# Altium schematic sheet Schematic.SchDoc
size A; SheetNumber: 1; SheetTotal: 2
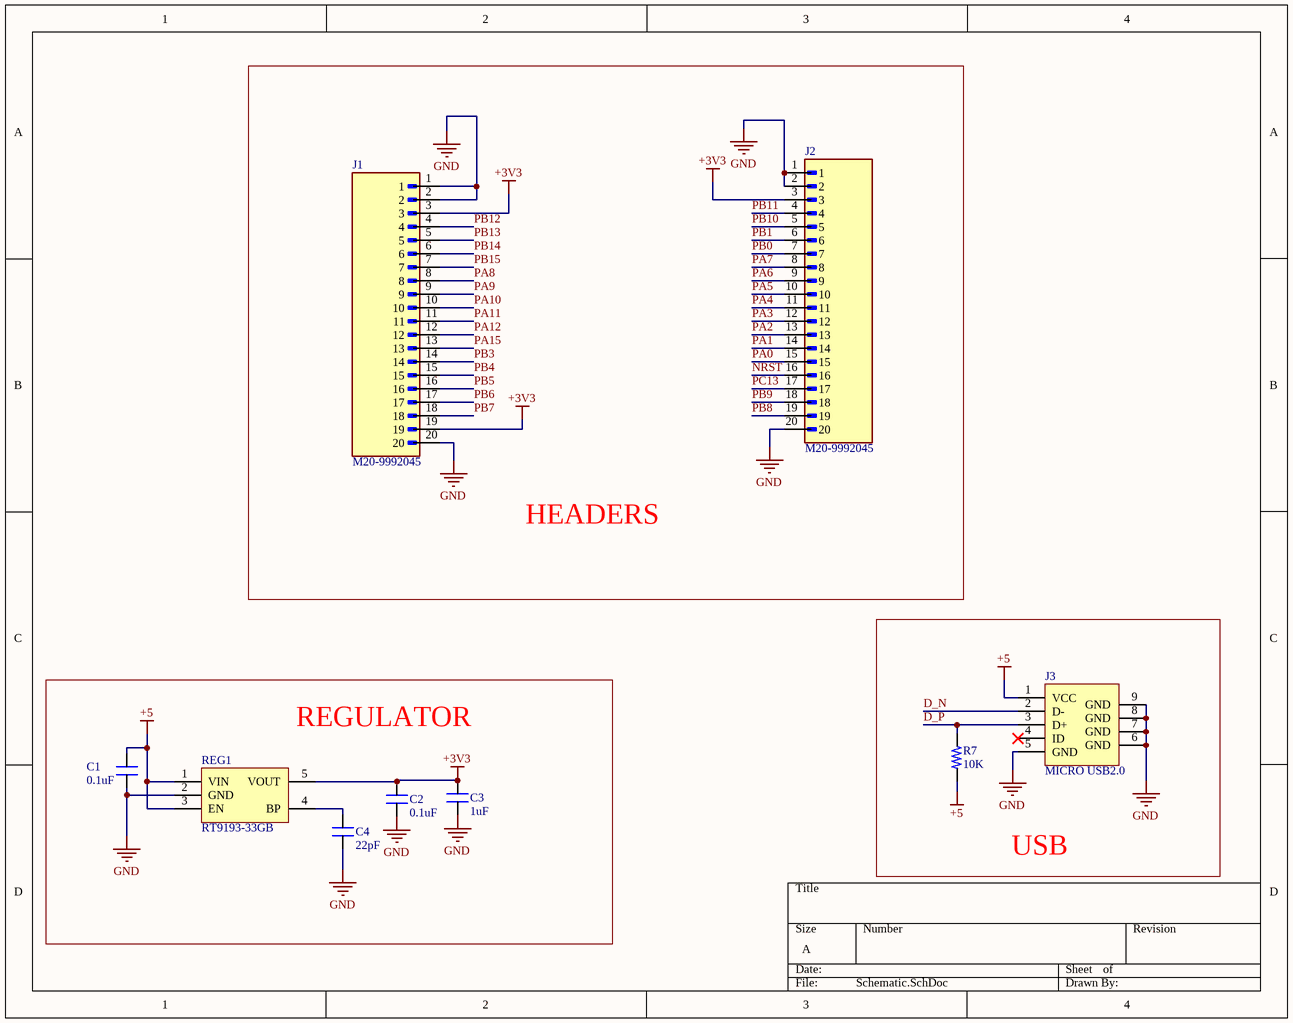
[diagram p0: Schematic.SchDoc]

## Parts
C1  0.1uF  [CAP_0805]
C2  0.1uF  [CAP_0805]
C3  1uF  [CAP_0805]
C4  22pF  [CAP_0805]
J1  M20-9992045  [HARWIN_M20-9992045]
J2  M20-9992045  [HARWIN_M20-9992045]
J3  MICRO USB2.0  [CON_10118192-0001LF_SMD]
R7  10K  [RES_0805]
REG1  RT9193-33GB  [SOT23-5]

## Blocks framed on the sheet
HEADERS: J1 J2
USB: J3 R7
REGULATOR: C1-C4 REG1

## Nets
+3V3: C2.2 C3.2 J1.3 J1.19 J2.3 REG1.5(VOUT)
+5: C1.2 J3.1(VCC) R7.1 REG1.1(VIN) REG1.3(EN)
GND: C1.1 C2.1 C3.1 C4.1 J1.1 J1.2 J1.20 J2.1 J2.2 J2.20 J3.5(GND) J3.6(GND) J3.7(GND) J3.8(GND) J3.9(GND) REG1.2(GND)
D_N: J3.2(D-)
D_P: J3.3(D+) R7.2
NRST: J2.16
PA0: J2.15
PA1: J2.14
PA2: J2.13
PA3: J2.12
PA4: J2.11
PA5: J2.10
PA6: J2.9
PA7: J2.8
PA8: J1.8
PA9: J1.9
PA10: J1.10
PA11: J1.11
PA12: J1.12
PA15: J1.13
PB0: J2.7
PB1: J2.6
PB3: J1.14
PB4: J1.15
PB5: J1.16
PB6: J1.17
PB7: J1.18
PB8: J2.19
PB9: J2.18
PB10: J2.5
PB11: J2.4
PB12: J1.4
PB13: J1.5
PB14: J1.6
PB15: J1.7
PC13: J2.17
NetC4_2: C4.2 REG1.4(BP)

Not connected (* = marked no-connect by the designer): J3 4(ID)*

## Library data of the parts
C1 C2 = CAP_0.1uF-50V-5%-0805: 0.1µF ±5% 50V Ceramic Capacitor X7R 0805 (2012 Metric); Manufacturer: KEMET; Manufacturing Part Number: C0805C104J5RACTU; Case/Package: 0805 (2012 Metric); Supplier-1: Digikey; Supplier Part Number-1: 399-1171-1-ND
C3 = CAP_1uF-50V-5%-0805: 1µF ±5% 50V Ceramic Capacitor X7R 0805 (2012 Metric); Manufacturer: Yageo; Manufacturing Part Number: CC0805JKX7R9BB105; Case/Package: 0805 (2012 Metric); Supplier-1: Digikey; Supplier Part Number-1: 311-3498-1-ND
C4 = CAP_22pF-50V-5%-0805: 22pF ±5% 50V Ceramic Capacitor C0G, NP0 0805 (2012 Metric); Manufacturer: KEMET; Manufacturer Part Number: C0805C220J5GACTU; Case/Package: 0805; Supplier-1: Digikey; Supplier Part Number-1: 399-1113-1-ND
J1 J2 = M20-9992045: 2.54mm (0.1") Pitch SIL Vertical Throughboard Pin Header, 6.1mm mating pin height, gold (hi-temp mould), 20 contacts; MF: Harwin; Package: None; Price: None; Value: *; SnapEDA_Link: https://www.snapeda.com/parts/M20-9992045/Harwin/view-part/?ref=snap; MP: M20-9992045; Availability: Unavailable; Check_prices: https://www.snapeda.com/parts/M20-9992045/Harwin/view-part/?ref=eda
J3 = CON-USB_10118192-0002LF-SMD: USB - micro B USB 2.0 Receptacle Connector 5 Position Surface Mount, Right Angle; Manufacturer: Amphenol ICC (FCI); Manufacturing Part Number: 10118192-0002LF; Case/Package: SMD; Supplier-1: Digikey; Supplier Part Number-1: 609-5379-1-ND
R7 = RES_10K-0.125W-1%-0805: 10 kOhms ±1% 0.125W, 1/8W Chip Resistor 0805 (2012 Metric) Moisture Resistant Thick Film; Manufacturer: Yageo; Manufacturing Part Number: RC0805FR-0710KL; Case/Package: 0805; Supplier-1: Digikey; Supplier Part Number-1: 311-10.0KCRCT-ND
REG1 = REG_3.3V-5.5V-0.3A-SOT-23-5: Linear Voltage Regulator IC 1 Output 300mA SOT-23-5; Manufacturer: Richtek USA Inc.; Manufacturer Part Number: RT9193-33GB; Case/ Package: SOT-23-5; Supplier-1: Digikey; Supplier Part Number-1: 1028-1014-1-ND